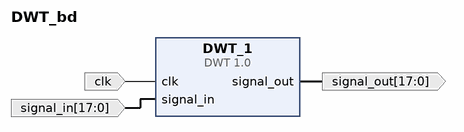
[diagram p0: block diagram of the top level]
# Vivado block design DWT_bd, xc7z020clg484-1, Vivado 2023.2
create_bd_design DWT_bd

create_bd_port -dir I -type clk clk
create_bd_port -dir I -from 17 -to 0 -type data signal_in
create_bd_port -dir O -from 17 -to 0 -type data signal_out

create_bd_cell -type ip -vlnv User_Company:VMC:DWT:1.0 DWT_1

# ---- connections ----

connect_bd_net [get_bd_pins DWT_1/signal_out] [get_bd_ports signal_out]
connect_bd_net [get_bd_ports clk] [get_bd_pins DWT_1/clk]
connect_bd_net [get_bd_ports signal_in] [get_bd_pins DWT_1/signal_in]

validate_bd_design
save_bd_design
